# Altium schematic sheet Power_Path.SchDoc
size 297 x 209 mm; SheetNumber: 2; SheetTotal: 3
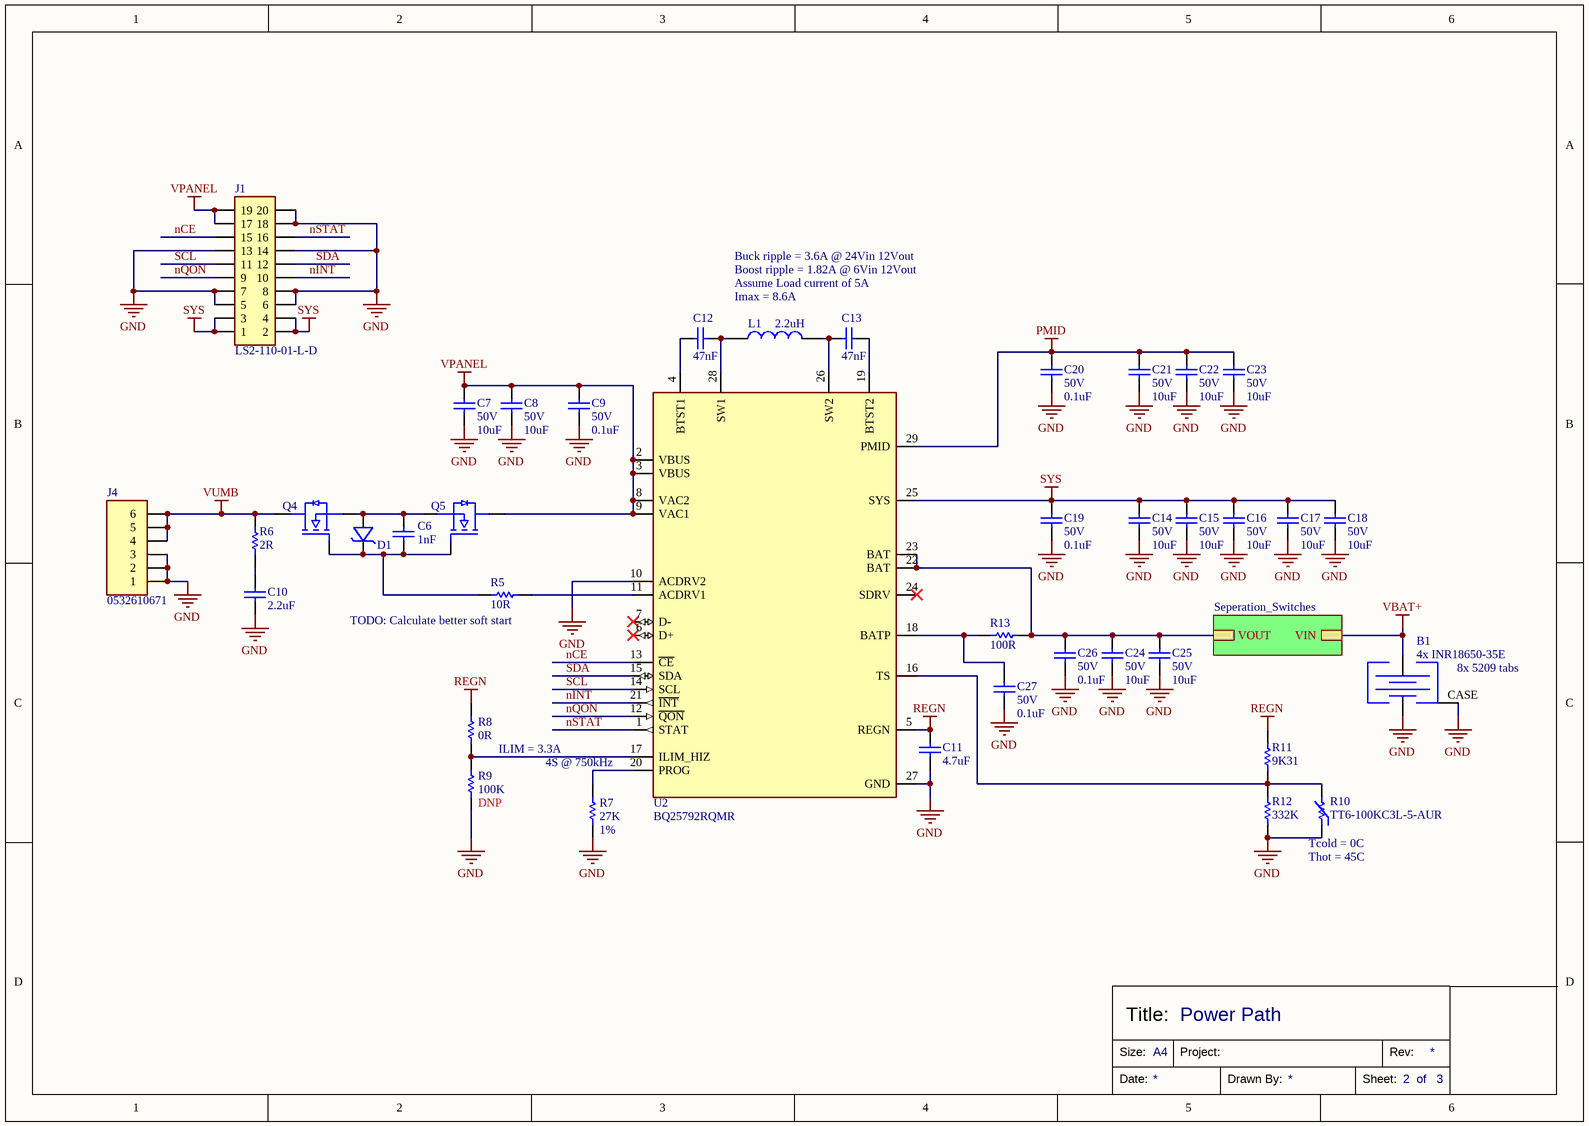
[diagram p0: Power_Path.SchDoc]

## Parts
B1  4x INR18650-35E  [4S Battery]
C6  Capacitance: 1nF  [CAPC0603X040]  (hidden comment: GRM1885C1H102JA01D)
C7  Voltage Rating: 50V  Capacitance: 10uF  [CAPC1210X090]  (hidden comment: CL32B106KBJNNNE)
C8  Voltage Rating: 50V  Capacitance: 10uF  [CAPC1210X090]  (hidden comment: CL32B106KBJNNNE)
C9  Voltage Rating: 50V  Capacitance: 0.1uF  [CAPC0402X020]  (hidden comment: CL05B104KB5NNNC)
C10  Capacitance: 2.2uF  [CAPC0805X060]  (hidden comment: CL21A225KBFNNNE)
C11  Capacitance: 4.7uF  [CAPC0805X060]  (hidden comment: CL21A475KAQNNNE)
C12  Capacitance: 47nF  [CAPC0603X040]  (hidden comment: C0603C473K1RACTU)
C13  Capacitance: 47nF  [CAPC0603X040]  (hidden comment: C0603C473K1RACTU)
C14  Voltage Rating: 50V  Capacitance: 10uF  [CAPC1210X090]  (hidden comment: CL32B106KBJNNNE)
C15  Voltage Rating: 50V  Capacitance: 10uF  [CAPC1210X090]  (hidden comment: CL32B106KBJNNNE)
C16  Voltage Rating: 50V  Capacitance: 10uF  [CAPC1210X090]  (hidden comment: CL32B106KBJNNNE)
C17  Voltage Rating: 50V  Capacitance: 10uF  [CAPC1210X090]  (hidden comment: CL32B106KBJNNNE)
C18  Voltage Rating: 50V  Capacitance: 10uF  [CAPC1210X090]  (hidden comment: CL32B106KBJNNNE)
C19  Voltage Rating: 50V  Capacitance: 0.1uF  [CAPC0402X020]  (hidden comment: CL05B104KB5NNNC)
C20  Voltage Rating: 50V  Capacitance: 0.1uF  [CAPC0402X020]  (hidden comment: CL05B104KB5NNNC)
C21  Voltage Rating: 50V  Capacitance: 10uF  [CAPC1210X090]  (hidden comment: CL32B106KBJNNNE)
C22  Voltage Rating: 50V  Capacitance: 10uF  [CAPC1210X090]  (hidden comment: CL32B106KBJNNNE)
C23  Voltage Rating: 50V  Capacitance: 10uF  [CAPC1210X090]  (hidden comment: CL32B106KBJNNNE)
C24  Voltage Rating: 50V  Capacitance: 10uF  [CAPC1210X090]  (hidden comment: CL32B106KBJNNNE)
C25  Voltage Rating: 50V  Capacitance: 10uF  [CAPC1210X090]  (hidden comment: CL32B106KBJNNNE)
C26  Voltage Rating: 50V  Capacitance: 0.1uF  [CAPC0402X020]  (hidden comment: CL05B104KB5NNNC)
C27  Voltage Rating: 50V  Capacitance: 0.1uF  [CAPC0402X020]  (hidden comment: CL05B104KB5NNNC)
D1  BZT52C12T-7  [SOD-523]  (value not drawn)
J1  LS2-110-01-L-D  [LS2-110-01-L-D]
J4  0532610671  [0532610671]
L1  Inductance: 2.2uH  [SPM7054VT-2R2M-D]  (hidden comment: SPM7054VT-2R2M-D)
Q4  CSD18511Q5A  [CSD18511Q5A]  (value not drawn)
Q5  CSD18511Q5A  [CSD18511Q5A]  (value not drawn)
R5  Resistance: 10R  [RESC0603]  (hidden comment: RMCF0603FT10R0)
R6  Resistance: 2R  [RESC0603]  (hidden comment: RMCF0603FT2R00)
R7  Tolerance: 1%  Resistance: 27K  [RESC0603]  (hidden comment: RMCF0603FT27K0)
R8  Resistance: 0R  [RESC0805]  (hidden comment: RMCF0805ZT0R00)
R9  Resistance: 100K  [RESC0805]  (hidden comment: RMCF0805FG100K)  (no BOM)
R10  TT6-100KC3L-5-AUR  [TT6-10KC8-9-25]
R11  Resistance: 9K31  [RESC0805]  (hidden comment: RMCF0805FT9K31)
R12  Resistance: 332K  [RESC0805]  (hidden comment: RMCF0805FT332K)
R13  Resistance: 100R  [RESC0805]  (hidden comment: RMCF0805FT100R)
U2  BQ25792RQMR  [BQ25792RQMR]

## Sub-sheets
Seperation_Switches = Seperation_Switches: VOUT, VIN

## Nets
GND: B1.1 B1.CASE C7.1 C8.1 C9.1 C10.1 C11.1 C14.1 C15.1 C16.1 C17.1 C18.1 C19.1 C20.1 C21.1 C22.1 C23.1 C24.1 C25.1 C26.1 C27.1 J1.5 J1.6 J1.7 J1.8 J1.13 J1.14 J1.18 J1.20 J4.1 J4.2 J4.3 R7.1 R9.1 R10.1 R12.1 U2.10(ACDRV2) U2.27(GND)
PMID: C20.2 C21.2 C22.2 C23.2 U2.29(PMID)
REGN: C11.2 R8.2 R11.2 U2.5(REGN)
SYS: C14.2 C15.2 C16.2 C17.2 C18.2 C19.2 J1.1 J1.2 J1.3 J1.4 U2.25(SYS)
VBAT+: B1.2 ; sheet Seperation_Switches/VIN
VPANEL: C7.2 C8.2 C9.2 J1.17 J1.19 Q5.2(D) U2.2(VBUS) U2.3(VBUS) U2.8(VAC2) U2.9(VAC1)
VUMB: J4.4 J4.5 J4.6 Q4.2(D) R6.2
nCE: J1.15 U2.13(~{CE})
nINT: J1.10 U2.21(~{INT})
nQON: J1.9 U2.12(~{QON})
nSTAT: J1.16 U2.1(STAT)
SCL: J1.11 U2.14(SCL)
SDA: J1.12 U2.15(SDA)
NetC6_1: C6.1 D1.K Q4.1(G) Q5.1(G) R5.1
NetC6_2: C6.2 D1.A Q4.3(S) Q5.3(S)
NetC10_2: C10.2 R6.1
NetC12_1: C12.1 U2.4(BTST1)
NetC12_2: C12.2 L1.1 U2.28(SW1)
NetC13_1: C13.1 L1.2 U2.26(SW2)
NetC13_2: C13.2 U2.19(BTST2)
NetC24_2: C24.2 C25.2 C26.2 R13.2 U2.22(BAT) U2.23(BAT) ; sheet Seperation_Switches/VOUT
NetC27_2: C27.2 R13.1 U2.18(BATP)
NetR5_2: R5.2 U2.11(ACDRV1)
NetR7_2: R7.2 U2.20(PROG)
NetR8_1: R8.1 R9.2 U2.17(ILIM_HIZ)
NetR10_2: R10.2 R11.1 R12.2 U2.16(TS)

Not connected (* = marked no-connect by the designer): U2 6(D+)* 7(D-)* 24(SDRV)*

## Notes on the sheet
- Buck ripple = 3.6A @ 24Vin 12Vout
- Boost ripple = 1.82A @ 6Vin 12Vout
- Assume Load current of 5A
- Imax = 8.6A
- (near R5) TODO: Calculate better soft start
- (near B1) 8x 5209 tabs
- (near R9) DNP
- ILIM = 3.3A
- 4S @ 750kHz
- (near R10) Tcold = 0C
- (near R10) Thot = 45C
- Power Path
- Size:
- Title:
- A4
- Project:
- Rev:
- Date:
- Drawn By:
- Sheet:
- of

## Library data of the parts
B1 = 4S Battery: Custom 4S battery component for Cubesat EPS; Part Number: N/A; Distributor Part Number: N/A
C6 = GRM1885C1H102JA01D: 1nF ±5% 50V Ceramic Capacitor C0G, NP0 0603 (1608 Metric); Manufacturer Part Number: GRM1885C1H102JA01D; Tolerance: 5%; Distributor Part number: 490-1451-1-ND; Case Code: 0603; Distributor: Digikey; Voltage Rating: 50V
C7 C8 C14-C18 C21-C25 = CL32B106KBJNNNE: 10 µF ±10% 50V Ceramic Capacitor X7R 1210 (3225 Metric); Manufacturer Part Number: CL32B106KBJNNNE; Distributor Part Number: 1276-3387-1-ND; Tolerance: 10%; Case Code: 1210; Distributor: Digikey
C9 C19 C20 C26 C27 = CL05B104KB5NNNC: 0.1 µF ±10% 50V Ceramic Capacitor X7R 0402 (1005 Metric); Part Number: CL05B104KB5NNNC; Tolerance: 10%; Distributor Part Number: 1276-CL05B104KB5NNNCCT-ND; Case Code: 0402; Distributor: Digikey
C10 = CL21A225KBFNNNE: 2.2uF ±10% 25V Ceramic Capacitor X7R 0805 (2012 Metric); Part Number: CL21A225KBFNNNE; Distributor Part Number: 1276-6702-1-ND; Tolerance: 10%; Case Code: 0805; Distributor: Digikey; Voltage Rating: 25V
C11 = CL21A475KAQNNNE: 4.7 µF ±10% 25V Ceramic Capacitor X5R 0805 (2012 Metric); Part Number: CL21A475KAQNNNE; Distributor Part Number: 1276-1244-1-ND; Tolerance: 10%; Case Code: 0805; Distributor: Digikey; Voltage Rating: 25V
C12 C13 = C0603C473K1RACTU: 0.047 µF ±10% 100V Ceramic Capacitor X7R 0603 (1608 Metric); Part Number: C0603C473K1RACTU; Distributor Part Number: 399-C0603C473K1RACTUCT-ND; Tolerance: 10%; Case Code: 0603; Distributor: Digikey; Voltage Rating: 100V
D1 = BZT52C12T-7: Zener Diode 12 V 300 mW ±5% Surface Mount SOD-523; Voltage - Zener: 12V; Power - Max: 300mW; Part Number: BZT52C12T-7; Distributor Part Number: BZT52C12T-7DICT-ND; Operating Temperature: -65°C ~ 150°C
J1 = LS2-110-01-L-D: Connector Self Mating 20 Position , Non-Gendered, Hermaphroditic Through Hole Gold; Number of Positions: 20; Contact Rating: 3.2A; Voltage Rating: 475VAC; Part Number: LS2-110-01-L-D; Distributor Part Number: SAM9665-ND; Distributor: Digikey; Number of Rows: 2; Operating Temperature: -55C ~ 125C
J4 = 0532610671: Connector Header Surface Mount, Right Angle 6 position 0.049" (1.25mm) Picoblade; Number of Positions: 6; Contact Current (Max): 1A; Material Flammability Rating: UL94 V-0; Part Number: 0532610671; Distributor Part Number: WM7624CT-ND; Distributor: Digikey
L1 = SPM7054VT-2R2M-D: 2.2 µH Shielded Drum Core, Wirewound Inductor 12 A 7.4mOhm Nonstandard; Tolerance: 20%; Current Rating: 12A; Current - Saturation: 14.1A; Part Number: SPM7054VT-2R2M-D; Distributor Part Number: 445-SPM7054VT-2R2M-DCT-ND; Distributor: Digikey; DC Resistance: 7.4mOhm; Operating Temperature: -55°C ~ 155°C
Q4 Q5 = CSD18511Q5A: 40-V, N channel NexFET™ power MOSFET, single SON 5 mm x 6 mm, 2.3 mOhm; Vgs (Max): 20; Vds (Max): 40V; Qg: 63nC; Qgd: 11.2nC; Vth: 1.8; Id: 27A; Power Dissipation (Max): 104W; Continuous Drain Current @ 25C: 159A; Part Number: CSD18511Q5A; Distributor Part Number: 296-48119-1-ND; Operating Temperature: -55°C ~ 150°C
R5 = RMCF0603FT10R0: 10 Ohms ±1% 0.1W, 1/10W Chip Resistor 0603 (1608 Metric) Automotive AEC-Q200 Thick Film; Manufacturer Part Number: RMCF0603FT10R0; Tolerance: 1%; Distributor: Digikey; Distributor Part Number: RMCF0603FT10R0CT-ND; Case Code: 0603
R6 = RMCF0603FT2R00: 2 Ohms ±1% 0.1W, 1/10W Chip Resistor 0603 (1608 Metric) Automotive AEC-Q200 Thick Film±1% 0.1W, 1/10W Chip Resistor 0603 (1608 Metric) Automotive AEC-Q200 Thick Film; Part Number: RMCF0603FT2R00; Tolerance: 1%; Distributor: Digikey; Distributor Part Number: RMCF0603FT2R00CT-ND; Case Code: 0603
R7 = RMCF0603FT27K0: 27 kOhms ±1% 0.1W, 1/10W Chip Resistor 0603 (1608 Metric) Automotive AEC-Q200 Thick Film; Part Number: RMCF0603FT27K0; Distributor: Digikey; Distributor Part Number: RMCF0603FT27K0CT-ND; Case Code: 0603
R8 = RMCF0805ZT0R00: 0 Ohms Jumper Chip Resistor 0805 (2012 Metric) Automotive AEC-Q200 Thick Film; Tolerance: 1%; Part Number: RMCF0805ZT0R00; Distributor Part Number: RMCF0805ZT0R00CT-ND; Distributor: Digikey; Case Code: 0805
R9 = RMCF0805FG100K: 100 kOhms ±1% 0.125W, 1/8W Chip Resistor 0805 (2012 Metric) Automotive AEC-Q200 Thick Film; Part Number: RMCF0805FG100K; Tolerance: 1%; Distributor Part Number: RMCF0805FG100KCT-ND; Distributor: Digikey; Case Code: 0805
R10 = TT6-100KC3L-5-AUR: NTC Thermistor 10k Probe; Part Number: TT6-100KC3L-5-AUR; Distributor Part Number: 1912-TT6-10KC8-9-25-ND; Distributor: Digikey; Operating Temperature: -30°C ~ 120°C; Resistance @ 25C: 10k
R11 = RMCF0805FT9K31: 9.31 kOhms ±1% 0.125W, 1/8W Chip Resistor 0805 (2012 Metric) Automotive AEC-Q200 Thick Film; Part Number: RMCF0805FT9K31; Tolerance: 1%; Distributor Part Number: 738-RMCF0805FT9K31CT-ND; Distributor: Digikey; Case Code: 0805
R12 = RMCF0805FT332K: 332 kOhms ±1% 0.125W, 1/8W Chip Resistor 0805 (2012 Metric) Automotive AEC-Q200 Thick Film; Part Number: RMCF0805FT332K; Tolerance: 1%; Distributor Part Number: RMCF0805FT332KCT-ND; Distributor: Digikey; Case Code: 0805
R13 = RMCF0805FT100R: 100 Ohms ±1% 0.125W, 1/8W Chip Resistor 0805 (2012 Metric) Automotive AEC-Q200 Thick Film; Part Number: RMCF0805FT100R; Tolerance: 1%; Distributor Part Number: RMCF0805FT100RCT-ND; Distributor: Digikey; Case Code: 0805
U2 = BQ25792RQMR: I2C Controlled, 1-4 Cell, 5-A Buck-Boost Battery Charger with Dual-Input / Selector and USB PD 3.0 OTG Output; Number of Cells: 1 ~ 4; Charge Current - Max: 5A; Battery Pack Voltage (Max): 18.8V; Voltage - Supply (Max): 24V; Part Number: BQ25792RQMR; Distributor Part Number: 296-BQ25792RQMRCT-ND; Distributor: Digikey; Operating Temperature: -40°C ~ 85°C